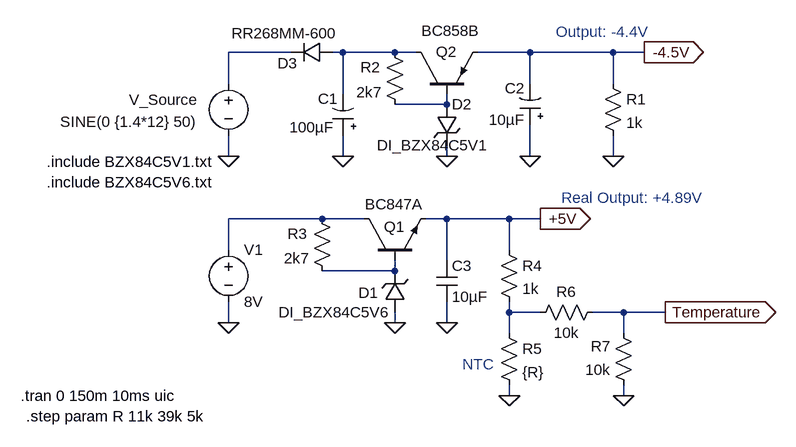
[diagram p0: schematic Power Supply.asc]
Power Supply.asc, the LTspice schematic file:
Version 4
SHEET 1 880 680
WIRE -784 -480 -880 -480
WIRE -704 -480 -720 -480
WIRE -624 -480 -704 -480
WIRE -592 -480 -624 -480
WIRE -416 -480 -496 -480
WIRE -288 -480 -416 -480
WIRE -240 -480 -288 -480
WIRE -880 -432 -880 -480
WIRE -416 -432 -416 -480
WIRE -288 -432 -288 -480
WIRE -704 -416 -704 -480
WIRE -544 -400 -544 -416
WIRE -544 -400 -624 -400
WIRE -880 -320 -880 -352
WIRE -704 -320 -704 -352
WIRE -544 -320 -544 -336
WIRE -416 -320 -416 -368
WIRE -288 -320 -288 -352
WIRE -736 -224 -880 -224
WIRE -672 -224 -736 -224
WIRE -544 -224 -576 -224
WIRE -448 -224 -544 -224
WIRE -400 -224 -448 -224
WIRE -880 -176 -880 -224
WIRE -448 -176 -448 -224
WIRE -544 -160 -544 -224
WIRE -624 -144 -624 -160
WIRE -624 -144 -736 -144
WIRE -448 -80 -448 -96
WIRE -400 -80 -448 -80
WIRE -272 -80 -320 -80
WIRE -208 -80 -272 -80
WIRE -880 -64 -880 -96
WIRE -624 -64 -624 -80
WIRE -544 -64 -544 -96
WIRE -448 -48 -448 -80
WIRE -272 -48 -272 -80
WIRE -448 48 -448 32
WIRE -272 48 -272 32
FLAG -880 -320 0
FLAG -704 -320 0
FLAG -544 -320 0
FLAG -416 -320 0
FLAG -240 -480 -4.5V
IOPIN -240 -480 Out
FLAG -288 -320 0
FLAG -880 -64 0
FLAG -624 -64 0
FLAG -400 -224 +5V
IOPIN -400 -224 Out
FLAG -544 -64 0
FLAG -448 48 0
FLAG -272 48 0
FLAG -208 -80 Temperature
IOPIN -208 -80 Out
SYMBOL voltage -880 -448 R0
WINDOW 3 -47 75 Right 2
WINDOW 123 0 0 Left 2
WINDOW 39 0 0 Left 2
WINDOW 0 -153 41 Left 2
SYMATTR Value SINE(0 {1.4*12} 50)
SYMATTR InstName V_Source
SYMBOL res -640 -496 R0
WINDOW 0 -37 39 Left 2
WINDOW 3 -43 77 Left 2
SYMATTR InstName R2
SYMATTR Value 2k7
SYMBOL zener -560 -400 R0
WINDOW 3 -92 63 Left 2
SYMATTR Value DI_BZX84C5V1
SYMATTR InstName D2
SYMATTR Description Diode
SYMATTR Type diode
SYMATTR Prefix X
SYMBOL diode -720 -496 R90
WINDOW 0 48 69 VBottom 2
WINDOW 3 -29 73 VTop 2
SYMATTR InstName D3
SYMATTR Value RR268MM-600
SYMBOL pnp -592 -416 R270
WINDOW 0 65 31 VRight 2
WINDOW 3 97 9 VRight 2
SYMATTR InstName Q2
SYMATTR Value BC858B
SYMBOL polcap -688 -352 R180
WINDOW 0 24 57 Left 2
WINDOW 3 29 13 Left 2
SYMATTR InstName C1
SYMATTR Value 100µF
SYMBOL polcap -400 -368 R180
WINDOW 0 24 57 Left 2
WINDOW 3 24 8 Left 2
SYMATTR InstName C2
SYMATTR Value 10µF
SYMBOL res -304 -448 R0
SYMATTR InstName R1
SYMATTR Value 1k
SYMBOL voltage -880 -192 R0
WINDOW 123 0 0 Left 0
WINDOW 39 0 0 Left 0
SYMATTR InstName V1
SYMATTR Value 8V
SYMBOL res -752 -240 R0
WINDOW 0 -37 39 Left 2
WINDOW 3 -43 77 Left 2
SYMATTR InstName R3
SYMATTR Value 2k7
SYMBOL npn -672 -160 R270
WINDOW 0 52 31 VRight 2
WINDOW 3 86 2 VRight 2
SYMATTR InstName Q1
SYMATTR Value BC847A
SYMBOL zener -608 -80 R180
WINDOW 3 24 0 Left 2
WINDOW 0 41 30 Left 2
SYMATTR Value DI_BZX84C5V6
SYMATTR InstName D1
SYMATTR Description Diode
SYMATTR Type diode
SYMATTR Prefix X
SYMBOL cap -560 -160 R0
SYMATTR InstName C3
SYMATTR Value 10µF
SYMBOL res -464 -192 R0
SYMATTR InstName R4
SYMATTR Value 1k
SYMBOL res -464 -64 R0
SYMATTR InstName R5
SYMATTR Value {R}
SYMBOL res -304 -96 R90
WINDOW 0 0 56 VBottom 2
WINDOW 3 32 56 VTop 2
SYMATTR InstName R6
SYMATTR Value 10k
SYMBOL res -256 48 R180
WINDOW 0 36 76 Left 2
WINDOW 3 36 40 Left 2
SYMATTR InstName R7
SYMATTR Value 10k
TEXT -1160 -312 Left 2 !.include BZX84C5V1.txt
TEXT -1160 -280 Left 2 !.include BZX84C5V6.txt
TEXT -376 -512 Left 2 ;Output: -4.4V
TEXT -368 -256 Left 2 ;Real Output: +4.89V
TEXT -520 0 Left 2 ;NTC
TEXT -1200 48 Left 2 !.tran 0 150m 10ms uic
TEXT -1192 80 Left 2 !.step param R 11k 39k 5k

The netlist it stands for:
* Power Supply.asc
V_Source N001 0 SINE(0 {1.4*12} 50)
R2 N002 N003 2k7
XD2 N003 0 DI_BZX84C5V1  ; pins + -
D3 N002 N001 RR268MM-600
Q2 N002 N003 -4.5V 0 BC858B
C1 0 N002 100µF
C2 0 -4.5V 10µF
R1 -4.5V 0 1k
V1 N004 0 8V
R3 N004 N005 2k7
Q1 N004 N005 +5V 0 BC847A
XD1 0 N005 DI_BZX84C5V6  ; pins + -
C3 +5V 0 10µF
R4 +5V N006 1k
R5 N006 0 {R}
R6 Temperature N006 10k
R7 0 Temperature 10k
.model D D
.lib standard.dio
.model NPN NPN
.model PNP PNP
.lib standard.bjt
.include BZX84C5V1.txt
.include BZX84C5V6.txt
* Output: -4.4V
* Real Output: +4.89V
* NTC
.tran 0 150m 10ms uic
.step param R 11k 39k 5k
.backanno
.end